# Altium schematic sheet Sheet6.SchDoc
size A4
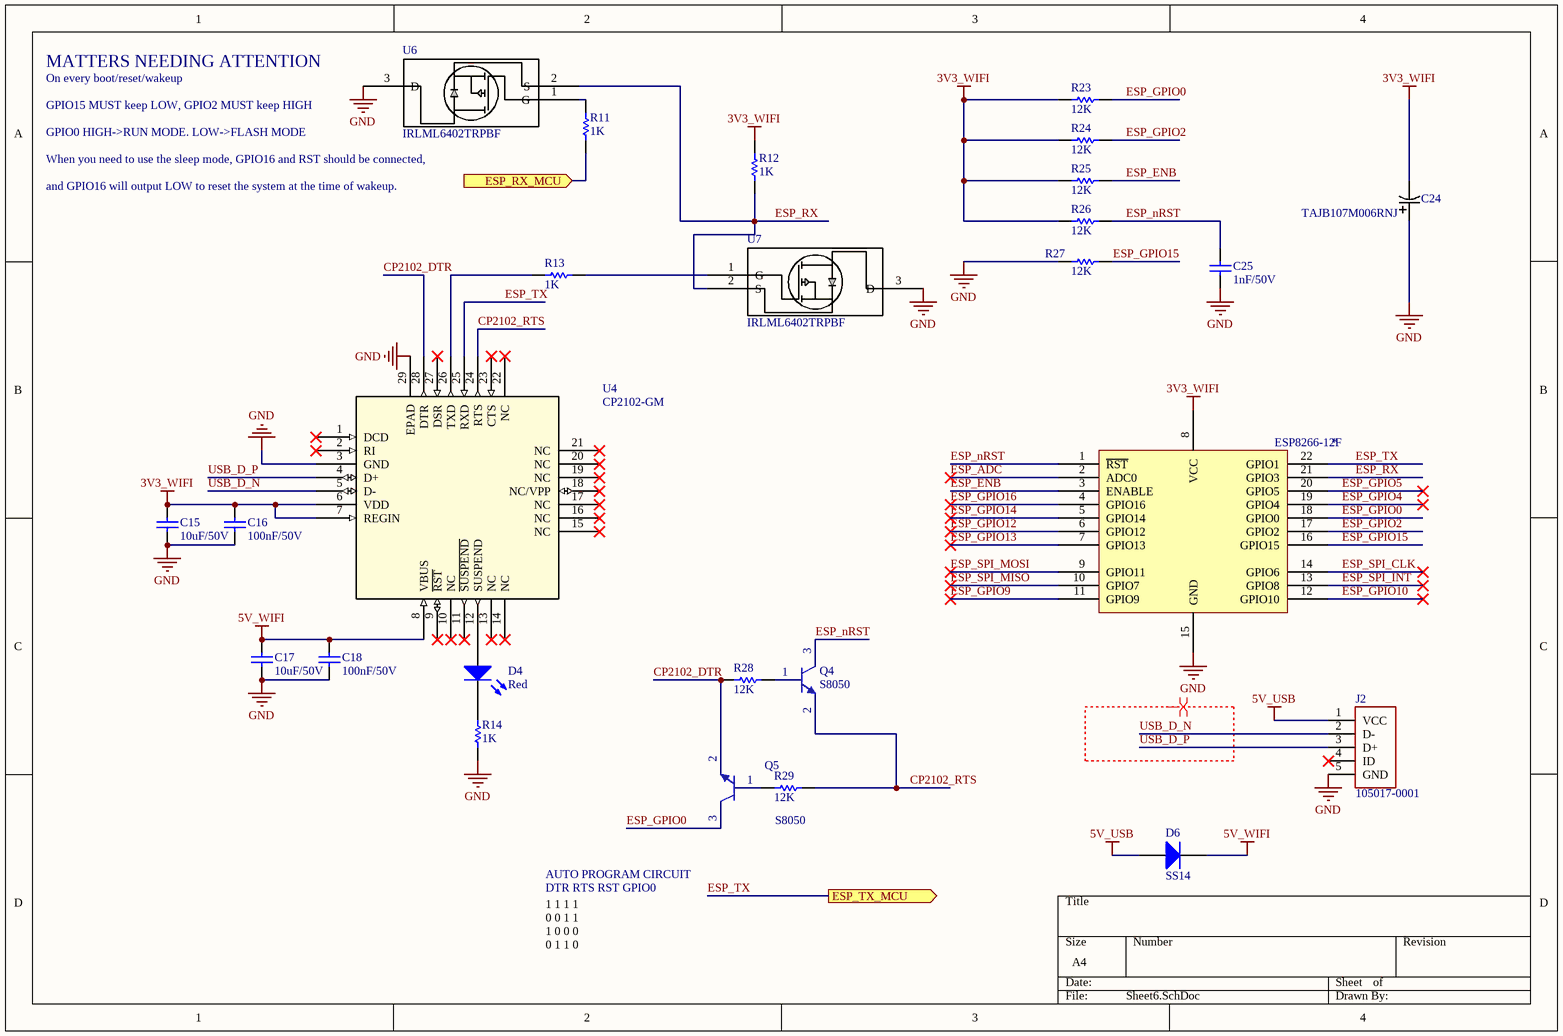
[diagram p0: Sheet6.SchDoc]

## Parts
*  ESP8266-12F  [ESP8266]
C15  value 10uF/50V  [CAP-SM-0805]  (hidden comment: Cap-1nF-50V-0805)
C16  value 100nF/50V  [CAP-SM-0805]  (hidden comment: Cap-1nF-50V-0805)
C17  value 10uF/50V  [CAP-SM-0805]  (hidden comment: Cap-1nF-50V-0805)
C18  value 100nF/50V  [CAP-SM-0805]  (hidden comment: Cap-1nF-50V-0805)
C24  TAJB107M006RNJ  [TAJB107M006RNJ]
C25  value 1nF/50V  [CAP-SM-0805]  (hidden comment: Cap-1nF-50V-0805)
D4  value Red  [LED-3mm]  (hidden comment: LED-RED-TH-3mm)
D6  SS14  [SS14]
J2  105017-0001  [CONN_105017-0001]
Q4  S8050  [SOT23_NEX]
Q5  S8050  [SOT23_NEX]
R11  value 1K  [RES-SM-0805]  (hidden comment: Res-470-0805)
R12  value 1K  [RES-SM-0805]  (hidden comment: Res-470-0805)
R13  value 1K  [RES-SM-0805]  (hidden comment: Res-470-0805)
R14  value 1K  [RES-SM-0805]  (hidden comment: Res-470-0805)
R23  value 12K  [RES-SM-0805]  (hidden comment: Res-0-0805)
R24  value 12K  [RES-SM-0805]  (hidden comment: Res-0-0805)
R25  value 12K  [RES-SM-0805]  (hidden comment: Res-0-0805)
R26  value 12K  [RES-SM-0805]  (hidden comment: Res-0-0805)
R27  value 12K  [RES-SM-0805]  (hidden comment: Res-0-0805)
R28  value 12K  [RES-SM-0805]  (hidden comment: Res-0-0805)
R29  value 12K  [RES-SM-0805]  (hidden comment: Res-0-0805)
U4  CP2102-GM  [cp2102-gm]
U6  IRLML6402TRPBF  [IRLML6402TRPBF]
U7  IRLML6402TRPBF  [IRLML6402TRPBF]

## Ports
ESP_RX_MCU (in), ESP_TX_MCU (out)

## Nets
3V3_WIFI: *.8(VCC) C15.2 C16.2 C24.2 R12.1 R23.1 R24.1 R25.1 R26.1 U4.6(VDD) U4.7(REGIN)
5V_USB: D6.2(A) J2.1(VCC)
5V_WIFI: C17.2 C18.2 D6.1(K) U4.8(VBUS)
GND: *.15(GND) C15.1 C16.1 C17.1 C18.1 C24.1 C25.1 J2.5(GND) R14.1 R27.1 U4.3(GND) U4.29(EPAD) U6.3(D) U7.3(D)
CP2102_DTR: Q5.2(E) R28.1 U4.28(DTR)
CP2102_RTS: Q4.2(E) R29.2 U4.24(RTS)
ESP_ADC: *.2(ADC0)
ESP_ENB: *.3(ENABLE) R25.2
ESP_GPIO0: *.18(GPIO0) Q5.3(C) R23.2
ESP_GPIO2: *.17(GPIO2) R24.2
ESP_GPIO4: *.19(GPIO4)
ESP_GPIO5: *.20(GPIO5)
ESP_GPIO9: *.11(GPIO9)
ESP_GPIO10: *.12(GPIO10)
ESP_GPIO12: *.6(GPIO12)
ESP_GPIO13: *.7(GPIO13)
ESP_GPIO14: *.5(GPIO14)
ESP_GPIO15: *.16(GPIO15) R27.2
ESP_GPIO16: *.4(GPIO16)
ESP_nRST: *.1(~{RST}) C25.2 Q4.3(C) R26.2
ESP_RX: *.21(GPIO3) R12.2 U6.2(S) U7.2(S)
ESP_RX_MCU: R11.1 ; port ESP_RX_MCU
ESP_SPI_CLK: *.14(GPIO6)
ESP_SPI_INT: *.13(GPIO8)
ESP_SPI_MISO: *.10(GPIO7)
ESP_SPI_MOSI: *.9(GPIO11)
ESP_TX: *.22(GPIO1) U4.25(RXD) ; port ESP_TX_MCU
USB_D_N: J2.2(D-) U4.5(D-)
USB_D_P: J2.3(D+) U4.4(D+)
NetD4_1: D4.1(A) U4.12(SUSPEND)
NetD4_2: D4.2(K) R14.2
NetQ4_1: Q4.1(B) R28.2
NetQ5_1: Q5.1(B) R29.1
NetR11_2: R11.2 U6.1(G)
NetR13_1: R13.1 U7.1(G)
NetR13_2: R13.2 U4.26(TXD)

Not connected (* = marked no-connect by the designer): J2 4(ID)*; U4 1(DCD)* 2(RI)* 9(~{RST})* 10(NC)* 11(~{SUSP}~{END})* 13(NC)* 14(NC)* 15(NC)* 16(NC)* 17(NC)* 18(NC/VPP)* 19(NC)* 20(NC)* 21(NC)* 22(NC)* 23(CTS)* 27(DSR)*

## Layout directives
differential pair: (no net found under the mark)

## Notes on the sheet
- MATTERS NEEDING ATTENTION
- On every boot/reset/wakeup
- GPIO15 MUST keep LOW, GPIO2 MUST keep HIGH
- GPIO0 HIGH->RUN MODE. LOW->FLASH MODE
- When you need to use the sleep mode, GPIO16 and RST should be connected,
- and GPIO16 will output LOW to reset the system at the time of wakeup.
- AUTO PROGRAM CIRCUIT
- DTR RTS RST GPIO0
- 1 1 1 1
  0 0 1 1
  1 0 0 0
  0 1 1 0

## Library data of the parts
* = ESP8266-12F: Local supply: Hshop; Local supply link: https://www.elecrow.com/download/ESP-12F.pdf
C15-C18 C25 = Cap-1nF-50V-0805: CAP CER 1000PF 100V X7R 0805; Manufacturer: Johanson Dielectrics Inc.; Manufacturer Part Number: 101X15W102MV4E; Local Supplier: thegioiic; Local Supplier Link: https://thegioiic.com/products/tu-1nf-50v-0805; Supplier 1: Digikey; Supplier 1 Link: https://www.digikey.com/product-detail/en/johanson-dielectrics-inc/101X15W102MV4E/709-1335-1-ND/2327235; Supplier 1 Part Number: 709-1335-1-ND
C24 = TAJB107M006RNJ: Vendor: AVX Corporation; Built_By: EMA_UL_Team; SourceLibrary: AVX_2015-1-12; Type: DEV; Manufacturer_Part_Number: TAJB107M006RNJ; Copyright: Copyright (C) 2018 Accelerated Designs. All rights reserved; RefDes: RefDes
D4 = LED-RED-TH-3mm: LED RED CLEAR T-1 T/H; Manufacturer: Kingbright; Manufacturer Part Number: WP710A10SEC/J3; Local Supplier: thegioiic; Local Supplier Link: https://thegioiic.com/products/led-do-3mm-chan-dai; Supplier 1: Digikey; Supplier 1 Link: https://www.digikey.com/product-detail/en/kingbright/WP710A10SEC-J3/754-1589-ND/2769815; Supplier 1 Part Number: 754-1589-ND
D6 = Diode-SS14: DIODE SCHOTTKY 40V 1A SMA; Manufacturer: ON Semiconductor; Local Supplier: thegioiic; Local Supplier Link: https://thegioiic.com/products/ss14-sma; Supplier 1: Digikey; Supplier 1 Link: https://www.digikey.com/product-detail/en/on-semiconductor/SS14/SS14CT-ND/965729; Manufacturer Part Number: SS14; Supplier 1 Part Number: SS14CT-ND
J2 = 105017-0001: No Description Available; Vendor: Molex Connector Corporation; Built_By: EMA_Cory; SourceLibrary: Molex_2020-05-26; Datasheet: https://www.molex.com/pdm_docs/sd/1050170001_sd.pdf; Manufacturer_Part_Number: 105017-0001; Copyright: Copyright (C) 2018 Accelerated Designs. All rights reserved; RefDes: RefDes; Type: DEV
R11-R14 = Res-470-0805: RES 470 OHM JUMPER 0805; Manufacturer: YAG6006CT-ND; Manufacturer Part Number: PE0805FRF7W0R047L; Local Supplier: thegioiic; Local Supplier Link: https://www.thegioiic.com/products/dien-tro-470-kohm-0805-5; Supplier 1: Digikey; Supplier 1 Link: https://www.digikey.com/product-detail/en/yageo/PE0805FRF7W0R047L/YAG6006CT-ND/9696460; Supplier 1 Part Number: YAG6006CT-ND
R23-R29 = Res-0-0805: RES 0 OHM JUMPER 0805; Manufacturer: Vishay Dale; Manufacturer Part Number: WSL080500000ZEA9; Local Supplier: thegioiic; Local Supplier Link: https://thegioiic.com/products/dien-tro-0-ohm-0805-5; Supplier 1: Digikey; Supplier 1 Link: https://www.digikey.com/product-detail/en/vishay-dale/WSL080500000ZEA9/541-3928-1-ND/7423223; Supplier 1 Part Number: 541-3928-1-ND
U4 = CP2102-GM: Vendor: Silicon Labs; Built_By: EMA_UL_Team; SourceLibrary: Silicon_Labs_2015-03-23; Manufacturer_Part_Number: CP2102-GM; Copyright: Copyright (C) 2018 Accelerated Designs. All rights reserved; RefDes: RefDes; Type: DEV
U6 U7 = IRLML6402TRPBF: No Description Available; Source_Library: Infineon_2020-02-27.xlr; Built_By: EMA_Justin; SourceLibrary: Infineon_2020-02-27; Vendor: Infineon; Copyright: Copyright (C) 2018 Accelerated Designs. All rights reserved; Manufacturer_Part_Number: IRLML6402TRPBF; RefDes: RefDes; Type: DEV